# EAGLE design blind_nina_b1_main (EAGLE 8.1.0)
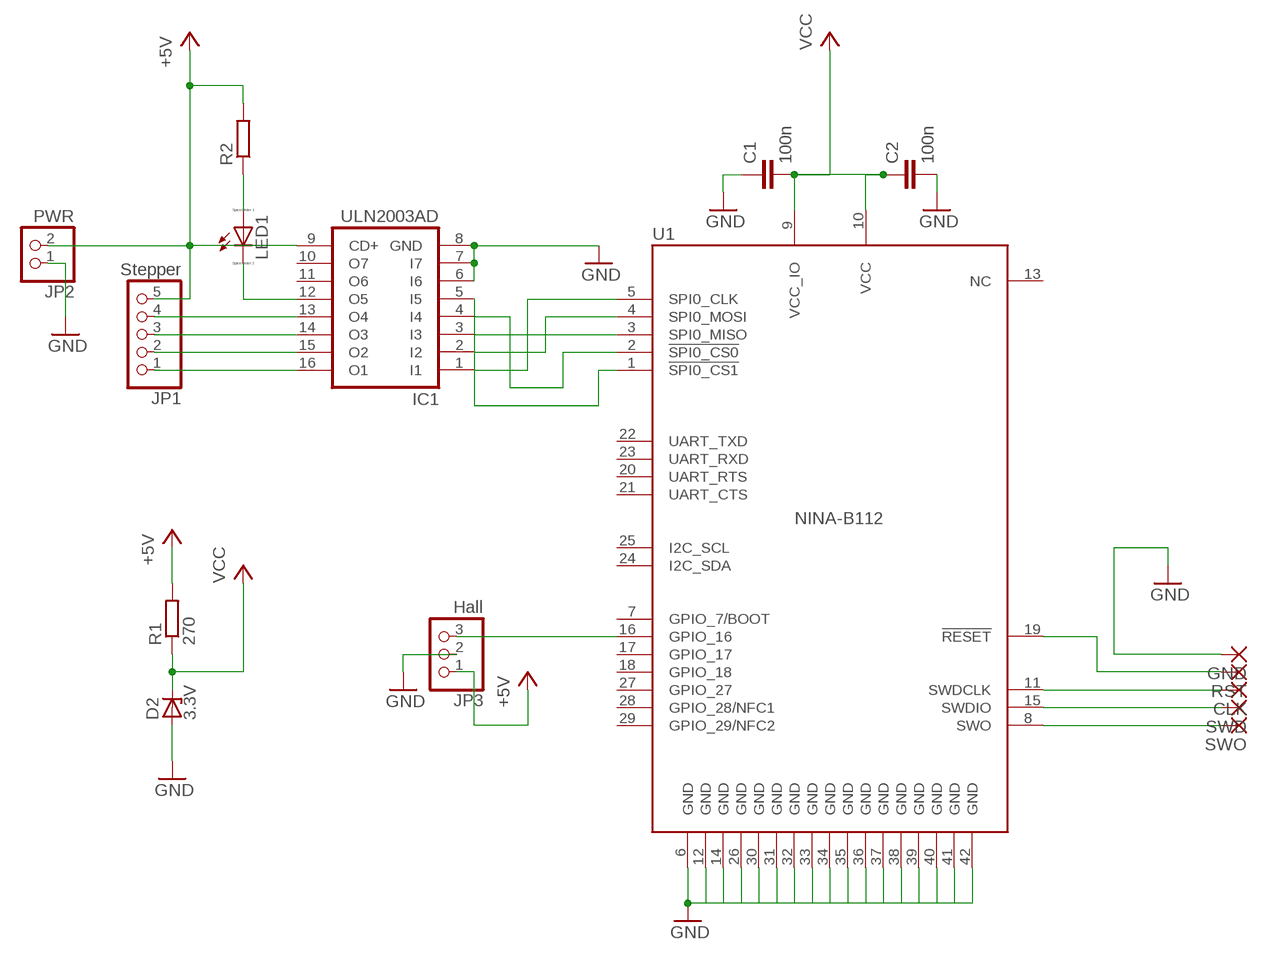
[diagram p0: schematic, sheet 1]

## Parts
C1  100n  C-EUC0603  [C0603]
C2  100n  C-EUC0603  [C0603]
CLK  SMD2  [SMD1,27-2,54]
D2  3.3V  ZENER-DIODESOD80C  [SOD80C]
GND  SMD2  [SMD1,27-2,54]
IC1  ULN2003AD  [SO16]
JP1  Stepper  PINHD-1X5  [1X05]
JP2  PWR  PINHD-1X2  [1X02]
JP3  Hall  PINHD-1X3  [1X03]
LED1  LED_E  [LED_1206]
R1  270  R-EU_R1210W  [R1210W]
R2  R-EU_R0603  [R0603]
RST  SMD2  [SMD1,27-2,54]
SWD  SMD2  [SMD1,27-2,54]
SWO  SMD2  [SMD1,27-2,54]
U1  NINA-B112  [NINA112-42]

## Nets
+5V [PWR]: IC1.9(CD+) JP1.5 JP2.2 JP3.1 R1.2 R2.2
GND [PWR]: C1.1 C2.2 D2.A GND.1(P) IC1.6(I6) IC1.7(I7) IC1.8(GND) JP2.1 JP3.2 U1.6(GND) U1.12(GND) U1.14(GND) U1.26(GND) U1.30(GND) U1.31(GND) U1.32(GND) U1.33(GND) U1.34(GND) U1.35(GND) U1.36(GND) U1.37(GND) U1.38(GND) U1.39(GND) U1.40(GND) U1.41(GND) U1.42(GND)
N$1: IC1.1(I1) U1.5(SPI0_CLK)
N$2: IC1.2(I2) U1.4(SPI0_MOSI)
N$3: IC1.3(I3) U1.3(SPI0_MISO)
N$4: IC1.4(I4) U1.2(!SPI0_CS0)
N$5: SWO.1(P) U1.8(SWO)
N$6 [PWR]: IC1.16(O1) JP1.1
N$7 [PWR]: IC1.15(O2) JP1.2
N$8 [PWR]: IC1.14(O3) JP1.3
N$9 [PWR]: IC1.13(O4) JP1.4
N$10: SWD.1(P) U1.15(SWDIO)
N$11: CLK.1(P) U1.11(SWDCLK)
N$12: RST.1(P) U1.19(!RESET)
N$13: IC1.12(O5) LED1.C
N$14: JP3.3 U1.16(GPIO_16)
N$15: LED1.A R2.1
N$16: IC1.5(I5) U1.1(!SPI0_CS1!)
VCC [PWR]: C1.2 C2.1 D2.C R1.1 U1.9(VCC_IO) U1.10(VCC)
Unconnected: IC1.10(O7) IC1.11(O6) U1.7(GPIO_7/BOOT) U1.13(NC) U1.17(GPIO_17) U1.18(GPIO_18) U1.20(UART_RTS) U1.21(UART_CTS) U1.22(UART_TXD) U1.23(UART_RXD) U1.24(I2C_SDA) U1.25(I2C_SCL) U1.27(GPIO_27) U1.28(GPIO_28/NFC1) U1.29(GPIO_29/NFC2)

## Library data of the parts
C1 C2 = resistor:C-EU: CAPACITOR, European symbol
CLK GND RST SWD SWO = wirepad:SMD2: SMD PAD
D2 = diode:ZENER-DIODE: Z-Diode
IC1 = uln-udn:ULN2003A: DRIVER ARRAY
JP1 = pinhead:PINHD-1X5: PIN HEADER
JP2 = pinhead:PINHD-1X2: PIN HEADER
JP3 = pinhead:PINHD-1X3: PIN HEADER
LED1 = eagle-ltspice:LED_E: LED Source: http://www.osram.convergy.de Source: www.luxeon.com Source: www.kingbright.com; SPICEMODEL: NONE; SPICEPREFIX: D; SPICETYPE: diode
R1 R2 = resistor:R-EU_: RESISTOR, European symbol
U1 = ubloxLib:NINA-B112: NINA-B112: BLE stand-alone module u-blox.com

## Net classes
0 default: width 0.254 mm, clearance 0.254 mm
1 PWR: width 0.508 mm, clearance 0.254 mm

## Board
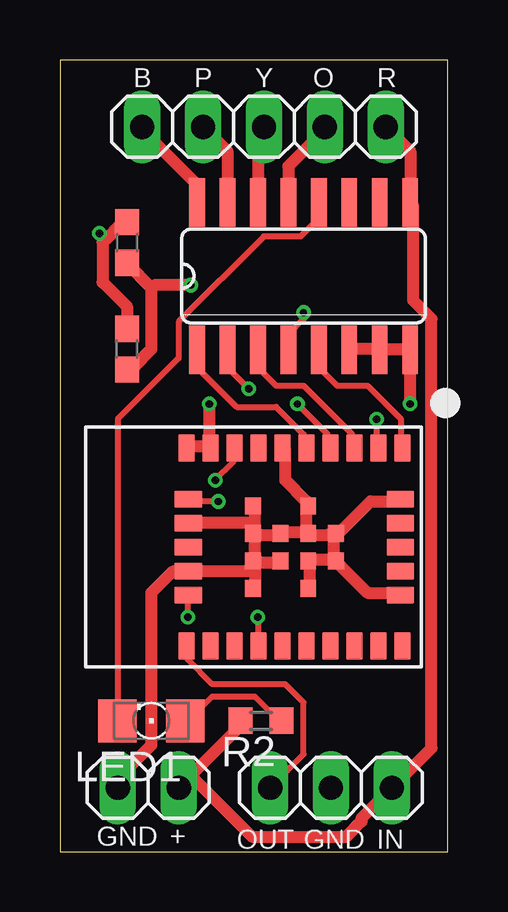
[diagram p1: board, top side]
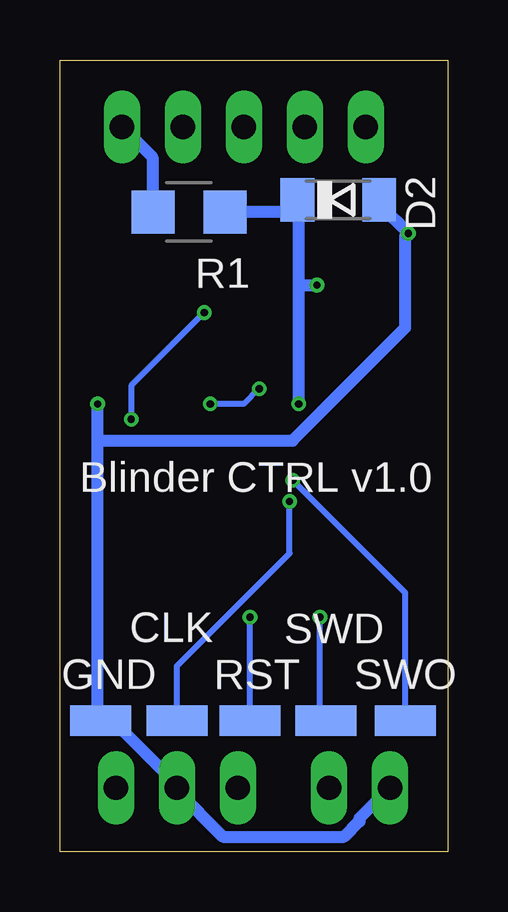
[diagram p2: board, bottom side, seen from below]

Size 16.18 x 33.01 mm. Coordinates in mm from the lower left corner, seen from the top.
Outline: 0,0 16.18,0 16.18,33.01 0,33.01 0,0
Copper layers (1*16): Top 0.035mm / dielectric 1.5mm / Bottom 0.035mm
Design rules "ITEADstudioDRC": minimum track width 6mil, minimum drill 12mil, track to track 6mil, track to pad 6mil, pad to pad 6mil, via to via 6mil, smd to smd 0mil, copper to edge 10mil, drill to drill 10mil, minimum pad ring 10mil, minimum via ring 6mil, stop-mask expansion 2mil, vias tented up to drill 100mil, thermal gap 10mil

### Footprints (pad centres in the part's own frame; a part is rotated, then mirrored left to right if it is on the bottom)
C0603 = smd 1.1 x 1: 1 -0.85,0; 2 0.85,0
SMD1,27-2,54 = smd 1.27 x 2.54: 1 0,0
SOD80C = smd 1.4 x 1.8: A 1.7,0; C -1.7,0
SO16 = smd 0.66 x 2.032: 1 -4.445,-3.073; 2 -3.175,-3.073; 3 -1.905,-3.073; 4 -0.635,-3.073; 5 0.635,-3.073; 6 1.905,-3.073; 7 3.175,-3.073; 8 4.445,-3.073; 9 4.445,3.073; 10 3.175,3.073; 11 1.905,3.073; 12 0.635,3.073; 13 -0.635,3.073; 14 -1.905,3.073; 15 -3.175,3.073; 16 -4.445,3.073
1X05 = drill 1.016 long: 1 -5.08,0; 2 -2.54,0; 3 0,0; 4 2.54,0; 5 5.08,0
1X02 = drill 1.016 long: 1 -1.27,0; 2 1.27,0
1X03 = drill 1.016 long: 1 -2.54,0; 2 0,0; 3 2.54,0
LED_1206 = smd 1.6 x 1.803: A -1.422,0; C 1.422,0
R1210W = smd 1.8 x 1.8: 1 -1.499,0; 2 1.499,0
R0603 = smd 1 x 1.1: 1 -0.85,0; 2 0.85,0
NINA112-42 = smd 0.7 x 1.15: 1 -4.5,-4.125; 2 -3.5,-4.125; 3 -2.5,-4.125; 4 -1.5,-4.125; 5 -0.5,-4.125; 6 0.5,-4.125; 7 1.5,-4.125; 8 2.5,-4.125; 9 3.5,-4.125; 10 4.5,-4.125; 16 4.5,4.125; 17 3.5,4.125; 18 2.5,4.125; 19 1.5,4.125; 20 0.5,4.125; 21 -0.5,4.125; 22 -1.5,4.125; 23 -2.5,4.125; 24 -3.5,4.125; 25 -4.5,4.125 | smd 1.15 x 0.7: 11 4.425,-2; 12 4.425,-1; 13 4.425,0; 14 4.425,1; 15 4.425,2; 26 -4.425,2; 27 -4.425,1; 28 -4.425,0; 29 -4.425,-1; 30 -4.425,-2 | smd 0.7 x 0.7: 31 -1.725,-0.575; 32 -1.725,0.575; 33 -0.575,-1.725; 34 -0.575,-0.575; 35 -0.575,0.575; 36 -0.575,1.725; 37 0.575,-0.575; 38 0.575,0.575; 39 1.725,-1.725; 40 1.725,-0.575; 41 1.725,0.575; 42 1.725,1.725

### Placement (x,y rotation side)
C1  2.79,25.4 270 top
C2  2.79,20.95 90 top
CLK  11.3,5.46 90 bottom
D2  4.57,27.18 0 bottom
GND  14.48,5.46 270 bottom
IC1  10.16,24 0 top
JP1  8.51,30.23 0 top
JP2  3.68,2.67 0 top
JP3  11.3,2.67 180 top
LED1  3.81,5.46 180 top
R1  10.79,26.67 180 bottom
R2  8.38,5.46 180 top
RST  8.26,5.46 270 bottom
SWD  5.08,5.46 270 bottom
SWO  1.78,5.46 270 bottom
U1  9.78,12.7 180 top

### Tracks (layer width: path | path; a pad name or v marks a point on that pad's centre or on a via)
+5V
  Top 0.508: JP1.5 14.61,29.21 IC1.9 14.73,26.92 14.73,22.99 15.49,22.23 15.49,4.32 JP3.1 12.57,1.4 12.57,1.27 11.94,0.64 8,0.64 5.59,3.05 JP2.2 7.49,5.21 7.49,5.46 R2.2
  Bottom 0.508: JP1.5 12.32,28.96 12.32,26.67 R1.2
GND  (via drill 0.3)
  Top 0.508: U1.36 10.41,11.05 10.41,12.06 U1.35 10.54,12.19 11.43,12.19 U1.32 | U1.31 11.43,13.21 11.43,12.45 U1.32 | U1.26 14.1,10.79 12.83,10.79 11.68,11.94 U1.32 | U1.30 14.1,14.61 12.95,14.61 11.68,13.34 U1.31 | 8.13,11.68 8.13,12.06 U1.41 | 8.13,11.68 8.13,11.05 U1.42 | U1.38 9.14,12.06 8.38,12.06 U1.41 | U1.40 8.13,13.21 8.13,12.32 U1.41 | U1.40 8.38,13.21 9.14,13.21 U1.37 9.4,13.34 10.29,13.34 U1.34 | 8.13,13.72 8.13,13.46 U1.40 | 8.13,13.72 8.13,14.35 U1.39 | U1.34 10.29,13.59 10.29,14.35 U1.33 10.29,14.61 9.4,15.49 9.4,16.76 U1.6 | 8.13,11.68 5.46,11.68 U1.14 5.21,11.68 4.7,11.68 3.81,10.79 3.81,4.45 2.41,3.05 JP2.1 | 8.13,13.72 5.46,13.72 U1.12 | U1.31 11.18,13.21 10.54,13.21 U1.34 | C2.2 2.79,22.73 1.78,23.75 1.78,25.4 1.91,25.53 | 1.91,25.53 2.54,26.16 2.79,26.16 C1.1 | v1.65,25.78 1.91,25.53 | IC1.6 12.06,20.95 13.34,20.95 IC1.7 13.46,20.95 14.61,20.95 IC1.8 v14.61,18.67
  Bottom 0.508: D2.A 2.79,27.18 2.79,26.92 v1.65,25.78 1.78,25.65 1.78,21.84 6.48,17.14 14.61,17.14 | 14.61,17.14 14.61,5.59 GND.1 13.97,5.46 11.3,2.79 JP3.2 11.3,2.54 9.4,0.64 4.32,0.64 3.68,1.27 3.68,1.4 JP2.1 | 14.61,17.14 v14.61,18.67
N$1
  Top 0.254: IC1.1 5.71,20.19 7.37,18.54 9.02,18.54 10.16,17.4 10.16,16.89 U1.5
N$2  (via drill 0.3)
  Top 0.254: v9.91,18.67 11.18,17.4 11.18,16.89 U1.4 | v7.87,19.3 6.99,20.19 IC1.2
  Bottom 0.254: v9.91,18.67 8.51,18.67 v7.87,19.3
N$3
  Top 0.254: IC1.3 8.26,20.19 9.02,19.43 10.16,19.43 12.19,17.4 12.19,16.89 U1.3
N$4  (via drill 0.3)
  Top 0.254: v13.21,18.03 13.21,16.89 U1.2 | v10.16,22.48 10.16,22.23 9.53,21.59 IC1.4
  Bottom 0.254: v13.21,18.03 13.21,19.43 v10.16,22.48
N$5  (via drill 0.3)
  Top 0.254: v6.48,15.49 7.24,16.26 7.24,16.76 U1.8
  Bottom 0.254: v6.48,15.49 1.78,10.79 SWO.1
N$6
  Top 0.508: IC1.16 5.71,27.81 3.43,30.1 JP1.1
N$7
  Top 0.508: IC1.15 6.99,29.21 JP1.2
N$8
  Top 0.508: IC1.14 8.26,29.97 JP1.3
N$9
  Top 0.508: IC1.13 9.53,28.57 11.05,30.1 JP1.4
N$10  (via drill 0.3)
  Top 0.254: v5.33,9.78 5.33,10.67 U1.15
  Bottom 0.254: v5.33,9.78 5.33,5.71 SWD.1
N$11  (via drill 0.3)
  Top 0.254: v6.6,14.61 5.46,14.61 U1.11
  Bottom 0.254: v6.6,14.61 6.6,12.45 11.3,7.75 CLK.1
N$12  (via drill 0.3)
  Top 0.254: v8.26,9.78 8.26,8.64 U1.19
  Bottom 0.254: RST.1 v8.26,9.78
N$13
  Top 0.254: IC1.12 10.79,26.42 10.03,25.65 8.51,25.65 4.95,22.1 4.95,20.57 2.41,18.03 2.41,5.46 LED1.C
N$14
  Top 0.254: JP3.3 10.16,4.06 10.16,6.22 9.4,6.99 6.35,6.99 5.33,8 5.33,8.51 U1.16
N$15
  Top 0.254: R2.1 9.14,5.46 8.13,6.48 6.35,6.48 5.33,5.46 LED1.A
N$16
  Top 0.254: IC1.5 10.79,20.19 11.56,19.43 12.83,19.43 14.22,18.03 14.22,16.89 U1.1
VCC  (via drill 0.3)
  Top 0.508: 3.81,23.5 3.81,20.95 3.05,20.19 2.79,20.19 C2.1 | 3.81,23.5 2.79,24.51 C1.2 | U1.10 5.33,16.89 6.22,16.89 U1.9 6.22,17.14 v6.22,18.67 | v5.46,23.62 3.94,23.62 3.81,23.5
  Bottom 0.508: 6.22,23.62 6.22,27.18 D2.C 6.35,26.67 R1.1 | 6.22,23.62 v6.22,18.67 | 6.22,23.62 v5.46,23.62

### Text on the board
tNames: B | P | Y | O | R | GND | + | OUT | GND | IN
bNames: Blinder CTRL v1.0